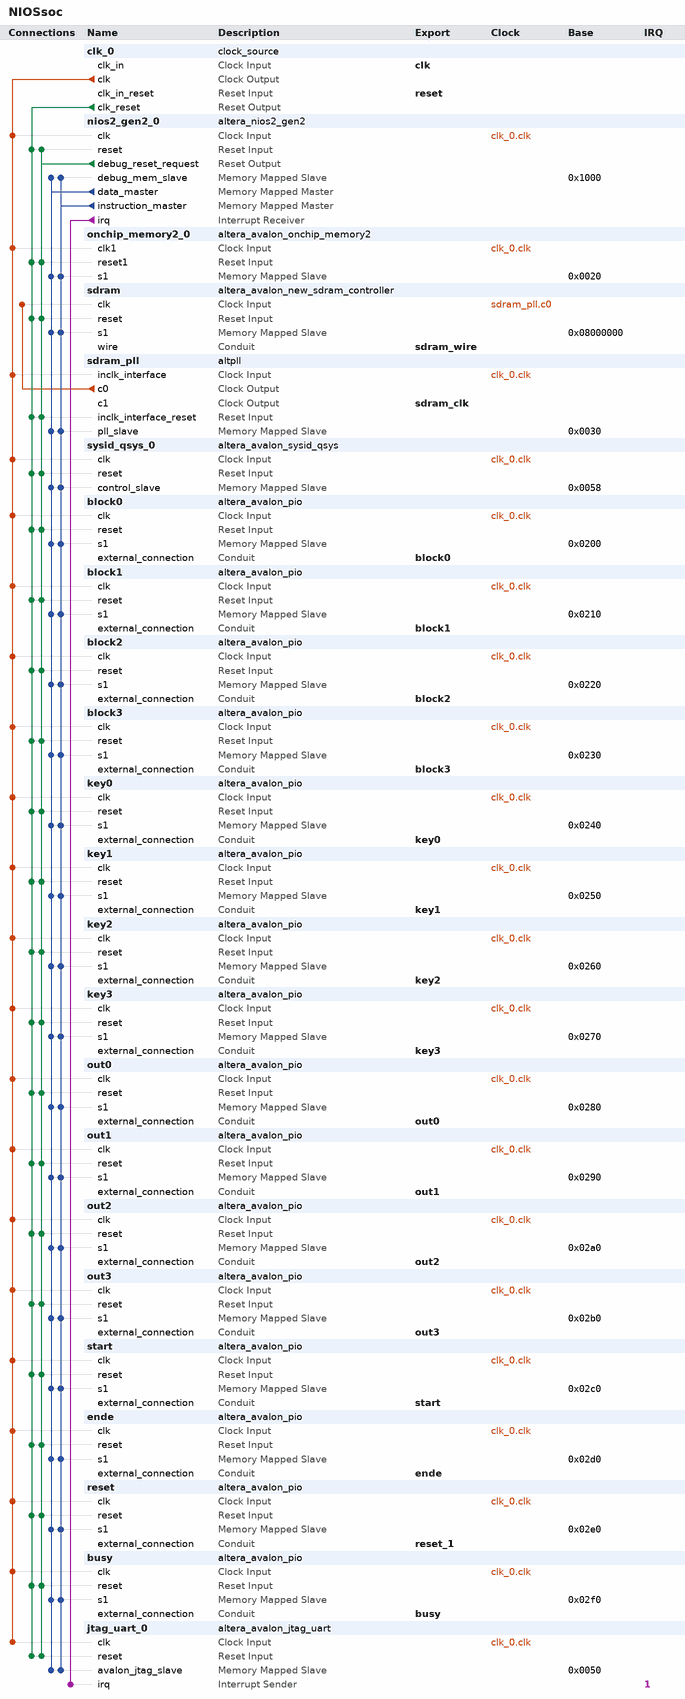
[diagram p0: system contents]
# Platform Designer (Qsys) system NIOSsoc, MAX 10 10M50DAF484C7G
# Parameters at their usual value, and those the tool derives, are not listed.
package require -exact qsys 18.1
create_system NIOSsoc
set_project_property DEVICE_FAMILY {MAX 10}
set_project_property DEVICE 10M50DAF484C7G

add_instance clk_0 clock_source 18.1
set_instance_parameter_value clk_0 clockFrequency 50000000

add_instance nios2_gen2_0 altera_nios2_gen2 18.1
set_instance_parameter_value nios2_gen2_0 dcache_size 2048
set_instance_parameter_value nios2_gen2_0 exceptionSlave sdram.s1
set_instance_parameter_value nios2_gen2_0 icache_size 4096
set_instance_parameter_value nios2_gen2_0 impl Tiny
set_instance_parameter_value nios2_gen2_0 resetSlave sdram.s1

add_instance onchip_memory2_0 altera_avalon_onchip_memory2 18.1
set_instance_parameter_value onchip_memory2_0 dataWidth 32
set_instance_parameter_value onchip_memory2_0 dualPort false
set_instance_parameter_value onchip_memory2_0 initMemContent true
set_instance_parameter_value onchip_memory2_0 initializationFileName onchip_mem.hex
set_instance_parameter_value onchip_memory2_0 memorySize 16

add_instance sdram altera_avalon_new_sdram_controller 18.1
set_instance_parameter_value sdram TAC 5.4
set_instance_parameter_value sdram TRCD 20.0
set_instance_parameter_value sdram TRP 20.0
set_instance_parameter_value sdram casLatency 3
set_instance_parameter_value sdram columnWidth 10
set_instance_parameter_value sdram dataWidth 16
set_instance_parameter_value sdram generateSimulationModel false
set_instance_parameter_value sdram model single_Micron_MT48LC4M32B2_7_chip
set_instance_parameter_value sdram numberOfBanks 4
set_instance_parameter_value sdram numberOfChipSelects 1
set_instance_parameter_value sdram powerUpDelay 200.0
set_instance_parameter_value sdram refreshPeriod 15.625
set_instance_parameter_value sdram rowWidth 13

add_instance sdram_pll altpll 18.1
set_instance_parameter_value sdram_pll CLK0_DIVIDE_BY 1
set_instance_parameter_value sdram_pll CLK0_MULTIPLY_BY 1
set_instance_parameter_value sdram_pll CLK1_DIVIDE_BY 1
set_instance_parameter_value sdram_pll CLK1_DUTY_CYCLE 50
set_instance_parameter_value sdram_pll CLK1_MULTIPLY_BY 1
set_instance_parameter_value sdram_pll CLK1_PHASE_SHIFT -1000
set_instance_parameter_value sdram_pll INCLK0_INPUT_FREQUENCY 20000
set_instance_parameter_value sdram_pll PORT_ARESET PORT_UNUSED
set_instance_parameter_value sdram_pll PORT_LOCKED PORT_UNUSED
set_instance_parameter_value sdram_pll PORT_clk1 PORT_USED
set_instance_parameter_value sdram_pll PORT_clk2 PORT_UNUSED
set_instance_parameter_value sdram_pll PORT_clk3 PORT_UNUSED

add_instance sysid_qsys_0 altera_avalon_sysid_qsys 18.1
set_instance_parameter_value sysid_qsys_0 id 0

add_instance block0 altera_avalon_pio 18.1
set_instance_parameter_value block0 direction Output
set_instance_parameter_value block0 width 32

add_instance block1 altera_avalon_pio 18.1
set_instance_parameter_value block1 direction Output
set_instance_parameter_value block1 width 32

add_instance block2 altera_avalon_pio 18.1
set_instance_parameter_value block2 direction Output
set_instance_parameter_value block2 width 32

add_instance block3 altera_avalon_pio 18.1
set_instance_parameter_value block3 direction Output
set_instance_parameter_value block3 width 32

add_instance key0 altera_avalon_pio 18.1
set_instance_parameter_value key0 direction Output
set_instance_parameter_value key0 width 32

add_instance key1 altera_avalon_pio 18.1
set_instance_parameter_value key1 direction Output
set_instance_parameter_value key1 width 32

add_instance key2 altera_avalon_pio 18.1
set_instance_parameter_value key2 direction Output
set_instance_parameter_value key2 width 32

add_instance key3 altera_avalon_pio 18.1
set_instance_parameter_value key3 direction Output
set_instance_parameter_value key3 width 32

add_instance out0 altera_avalon_pio 18.1
set_instance_parameter_value out0 direction Input
set_instance_parameter_value out0 width 32

add_instance out1 altera_avalon_pio 18.1
set_instance_parameter_value out1 direction Input
set_instance_parameter_value out1 width 32

add_instance out2 altera_avalon_pio 18.1
set_instance_parameter_value out2 direction Input
set_instance_parameter_value out2 width 32

add_instance out3 altera_avalon_pio 18.1
set_instance_parameter_value out3 direction Input
set_instance_parameter_value out3 width 32

add_instance start altera_avalon_pio 18.1
set_instance_parameter_value start direction Output
set_instance_parameter_value start width 1

add_instance ende altera_avalon_pio 18.1
set_instance_parameter_value ende direction Output
set_instance_parameter_value ende width 1

add_instance reset altera_avalon_pio 18.1
set_instance_parameter_value reset direction Output
set_instance_parameter_value reset width 1

add_instance busy altera_avalon_pio 18.1
set_instance_parameter_value busy direction Input
set_instance_parameter_value busy width 1

add_instance jtag_uart_0 altera_avalon_jtag_uart 18.1
set_instance_parameter_value jtag_uart_0 simInteractiveOptions NO_INTERACTIVE_WINDOWS

# connections
add_connection clk_0.clk block0.clk clock
add_connection clk_0.clk block1.clk clock
add_connection clk_0.clk block2.clk clock
add_connection clk_0.clk block3.clk clock
add_connection clk_0.clk busy.clk clock
add_connection clk_0.clk ende.clk clock
add_connection clk_0.clk jtag_uart_0.clk clock
add_connection clk_0.clk key0.clk clock
add_connection clk_0.clk key1.clk clock
add_connection clk_0.clk key2.clk clock
add_connection clk_0.clk key3.clk clock
add_connection clk_0.clk nios2_gen2_0.clk clock
add_connection clk_0.clk onchip_memory2_0.clk1 clock
add_connection clk_0.clk out0.clk clock
add_connection clk_0.clk out1.clk clock
add_connection clk_0.clk out2.clk clock
add_connection clk_0.clk out3.clk clock
add_connection clk_0.clk reset.clk clock
add_connection clk_0.clk sdram_pll.inclk_interface clock
add_connection clk_0.clk start.clk clock
add_connection clk_0.clk sysid_qsys_0.clk clock
add_connection sdram_pll.c0 sdram.clk clock
add_connection clk_0.clk_reset block0.reset reset
add_connection clk_0.clk_reset block1.reset reset
add_connection clk_0.clk_reset block2.reset reset
add_connection clk_0.clk_reset block3.reset reset
add_connection clk_0.clk_reset busy.reset reset
add_connection clk_0.clk_reset ende.reset reset
add_connection clk_0.clk_reset jtag_uart_0.reset reset
add_connection clk_0.clk_reset key0.reset reset
add_connection clk_0.clk_reset key1.reset reset
add_connection clk_0.clk_reset key2.reset reset
add_connection clk_0.clk_reset key3.reset reset
add_connection clk_0.clk_reset nios2_gen2_0.reset reset
add_connection clk_0.clk_reset onchip_memory2_0.reset1 reset
add_connection clk_0.clk_reset out0.reset reset
add_connection clk_0.clk_reset out1.reset reset
add_connection clk_0.clk_reset out2.reset reset
add_connection clk_0.clk_reset out3.reset reset
add_connection clk_0.clk_reset reset.reset reset
add_connection clk_0.clk_reset sdram.reset reset
add_connection clk_0.clk_reset sdram_pll.inclk_interface_reset reset
add_connection clk_0.clk_reset start.reset reset
add_connection clk_0.clk_reset sysid_qsys_0.reset reset
add_connection nios2_gen2_0.debug_reset_request block0.reset reset
add_connection nios2_gen2_0.debug_reset_request block1.reset reset
add_connection nios2_gen2_0.debug_reset_request block2.reset reset
add_connection nios2_gen2_0.debug_reset_request block3.reset reset
add_connection nios2_gen2_0.debug_reset_request busy.reset reset
add_connection nios2_gen2_0.debug_reset_request ende.reset reset
add_connection nios2_gen2_0.debug_reset_request jtag_uart_0.reset reset
add_connection nios2_gen2_0.debug_reset_request key0.reset reset
add_connection nios2_gen2_0.debug_reset_request key1.reset reset
add_connection nios2_gen2_0.debug_reset_request key2.reset reset
add_connection nios2_gen2_0.debug_reset_request key3.reset reset
add_connection nios2_gen2_0.debug_reset_request nios2_gen2_0.reset reset
add_connection nios2_gen2_0.debug_reset_request onchip_memory2_0.reset1 reset
add_connection nios2_gen2_0.debug_reset_request out0.reset reset
add_connection nios2_gen2_0.debug_reset_request out1.reset reset
add_connection nios2_gen2_0.debug_reset_request out2.reset reset
add_connection nios2_gen2_0.debug_reset_request out3.reset reset
add_connection nios2_gen2_0.debug_reset_request reset.reset reset
add_connection nios2_gen2_0.debug_reset_request sdram.reset reset
add_connection nios2_gen2_0.debug_reset_request sdram_pll.inclk_interface_reset reset
add_connection nios2_gen2_0.debug_reset_request start.reset reset
add_connection nios2_gen2_0.debug_reset_request sysid_qsys_0.reset reset
add_connection nios2_gen2_0.data_master block0.s1 avalon
set_connection_parameter_value nios2_gen2_0.data_master/block0.s1 baseAddress 0x0200
add_connection nios2_gen2_0.data_master block1.s1 avalon
set_connection_parameter_value nios2_gen2_0.data_master/block1.s1 baseAddress 0x0210
add_connection nios2_gen2_0.data_master block2.s1 avalon
set_connection_parameter_value nios2_gen2_0.data_master/block2.s1 baseAddress 0x0220
add_connection nios2_gen2_0.data_master block3.s1 avalon
set_connection_parameter_value nios2_gen2_0.data_master/block3.s1 baseAddress 0x0230
add_connection nios2_gen2_0.data_master busy.s1 avalon
set_connection_parameter_value nios2_gen2_0.data_master/busy.s1 baseAddress 0x02f0
add_connection nios2_gen2_0.data_master ende.s1 avalon
set_connection_parameter_value nios2_gen2_0.data_master/ende.s1 baseAddress 0x02d0
add_connection nios2_gen2_0.data_master jtag_uart_0.avalon_jtag_slave avalon
set_connection_parameter_value nios2_gen2_0.data_master/jtag_uart_0.avalon_jtag_slave baseAddress 0x0050
add_connection nios2_gen2_0.data_master key0.s1 avalon
set_connection_parameter_value nios2_gen2_0.data_master/key0.s1 baseAddress 0x0240
add_connection nios2_gen2_0.data_master key1.s1 avalon
set_connection_parameter_value nios2_gen2_0.data_master/key1.s1 baseAddress 0x0250
add_connection nios2_gen2_0.data_master key2.s1 avalon
set_connection_parameter_value nios2_gen2_0.data_master/key2.s1 baseAddress 0x0260
add_connection nios2_gen2_0.data_master key3.s1 avalon
set_connection_parameter_value nios2_gen2_0.data_master/key3.s1 baseAddress 0x0270
add_connection nios2_gen2_0.data_master nios2_gen2_0.debug_mem_slave avalon
set_connection_parameter_value nios2_gen2_0.data_master/nios2_gen2_0.debug_mem_slave baseAddress 0x1000
add_connection nios2_gen2_0.data_master onchip_memory2_0.s1 avalon
set_connection_parameter_value nios2_gen2_0.data_master/onchip_memory2_0.s1 baseAddress 0x0020
add_connection nios2_gen2_0.data_master out0.s1 avalon
set_connection_parameter_value nios2_gen2_0.data_master/out0.s1 baseAddress 0x0280
add_connection nios2_gen2_0.data_master out1.s1 avalon
set_connection_parameter_value nios2_gen2_0.data_master/out1.s1 baseAddress 0x0290
add_connection nios2_gen2_0.data_master out2.s1 avalon
set_connection_parameter_value nios2_gen2_0.data_master/out2.s1 baseAddress 0x02a0
add_connection nios2_gen2_0.data_master out3.s1 avalon
set_connection_parameter_value nios2_gen2_0.data_master/out3.s1 baseAddress 0x02b0
add_connection nios2_gen2_0.data_master reset.s1 avalon
set_connection_parameter_value nios2_gen2_0.data_master/reset.s1 baseAddress 0x02e0
add_connection nios2_gen2_0.data_master sdram.s1 avalon
set_connection_parameter_value nios2_gen2_0.data_master/sdram.s1 baseAddress 0x08000000
add_connection nios2_gen2_0.data_master sdram_pll.pll_slave avalon
set_connection_parameter_value nios2_gen2_0.data_master/sdram_pll.pll_slave baseAddress 0x0030
add_connection nios2_gen2_0.data_master start.s1 avalon
set_connection_parameter_value nios2_gen2_0.data_master/start.s1 baseAddress 0x02c0
add_connection nios2_gen2_0.data_master sysid_qsys_0.control_slave avalon
set_connection_parameter_value nios2_gen2_0.data_master/sysid_qsys_0.control_slave baseAddress 0x0058
add_connection nios2_gen2_0.instruction_master block0.s1 avalon
set_connection_parameter_value nios2_gen2_0.instruction_master/block0.s1 baseAddress 0x0200
add_connection nios2_gen2_0.instruction_master block1.s1 avalon
set_connection_parameter_value nios2_gen2_0.instruction_master/block1.s1 baseAddress 0x0210
add_connection nios2_gen2_0.instruction_master block2.s1 avalon
set_connection_parameter_value nios2_gen2_0.instruction_master/block2.s1 baseAddress 0x0220
add_connection nios2_gen2_0.instruction_master block3.s1 avalon
set_connection_parameter_value nios2_gen2_0.instruction_master/block3.s1 baseAddress 0x0230
add_connection nios2_gen2_0.instruction_master busy.s1 avalon
set_connection_parameter_value nios2_gen2_0.instruction_master/busy.s1 baseAddress 0x02f0
add_connection nios2_gen2_0.instruction_master ende.s1 avalon
set_connection_parameter_value nios2_gen2_0.instruction_master/ende.s1 baseAddress 0x02d0
add_connection nios2_gen2_0.instruction_master jtag_uart_0.avalon_jtag_slave avalon
set_connection_parameter_value nios2_gen2_0.instruction_master/jtag_uart_0.avalon_jtag_slave baseAddress 0x0050
add_connection nios2_gen2_0.instruction_master key0.s1 avalon
set_connection_parameter_value nios2_gen2_0.instruction_master/key0.s1 baseAddress 0x0240
add_connection nios2_gen2_0.instruction_master key1.s1 avalon
set_connection_parameter_value nios2_gen2_0.instruction_master/key1.s1 baseAddress 0x0250
add_connection nios2_gen2_0.instruction_master key2.s1 avalon
set_connection_parameter_value nios2_gen2_0.instruction_master/key2.s1 baseAddress 0x0260
add_connection nios2_gen2_0.instruction_master key3.s1 avalon
set_connection_parameter_value nios2_gen2_0.instruction_master/key3.s1 baseAddress 0x0270
add_connection nios2_gen2_0.instruction_master nios2_gen2_0.debug_mem_slave avalon
set_connection_parameter_value nios2_gen2_0.instruction_master/nios2_gen2_0.debug_mem_slave baseAddress 0x1000
add_connection nios2_gen2_0.instruction_master onchip_memory2_0.s1 avalon
set_connection_parameter_value nios2_gen2_0.instruction_master/onchip_memory2_0.s1 baseAddress 0x0020
add_connection nios2_gen2_0.instruction_master out0.s1 avalon
set_connection_parameter_value nios2_gen2_0.instruction_master/out0.s1 baseAddress 0x0280
add_connection nios2_gen2_0.instruction_master out1.s1 avalon
set_connection_parameter_value nios2_gen2_0.instruction_master/out1.s1 baseAddress 0x0290
add_connection nios2_gen2_0.instruction_master out2.s1 avalon
set_connection_parameter_value nios2_gen2_0.instruction_master/out2.s1 baseAddress 0x02a0
add_connection nios2_gen2_0.instruction_master out3.s1 avalon
set_connection_parameter_value nios2_gen2_0.instruction_master/out3.s1 baseAddress 0x02b0
add_connection nios2_gen2_0.instruction_master reset.s1 avalon
set_connection_parameter_value nios2_gen2_0.instruction_master/reset.s1 baseAddress 0x02e0
add_connection nios2_gen2_0.instruction_master sdram.s1 avalon
set_connection_parameter_value nios2_gen2_0.instruction_master/sdram.s1 baseAddress 0x08000000
add_connection nios2_gen2_0.instruction_master sdram_pll.pll_slave avalon
set_connection_parameter_value nios2_gen2_0.instruction_master/sdram_pll.pll_slave baseAddress 0x0030
add_connection nios2_gen2_0.instruction_master start.s1 avalon
set_connection_parameter_value nios2_gen2_0.instruction_master/start.s1 baseAddress 0x02c0
add_connection nios2_gen2_0.instruction_master sysid_qsys_0.control_slave avalon
set_connection_parameter_value nios2_gen2_0.instruction_master/sysid_qsys_0.control_slave baseAddress 0x0058
add_connection nios2_gen2_0.irq jtag_uart_0.irq interrupt
set_connection_parameter_value nios2_gen2_0.irq/jtag_uart_0.irq irqNumber 1

# exported interfaces
add_interface block0 conduit end
set_interface_property block0 EXPORT_OF block0.external_connection
add_interface block1 conduit end
set_interface_property block1 EXPORT_OF block1.external_connection
add_interface block2 conduit end
set_interface_property block2 EXPORT_OF block2.external_connection
add_interface block3 conduit end
set_interface_property block3 EXPORT_OF block3.external_connection
add_interface busy conduit end
set_interface_property busy EXPORT_OF busy.external_connection
add_interface clk clock sink
set_interface_property clk EXPORT_OF clk_0.clk_in
add_interface ende conduit end
set_interface_property ende EXPORT_OF ende.external_connection
add_interface key0 conduit end
set_interface_property key0 EXPORT_OF key0.external_connection
add_interface key1 conduit end
set_interface_property key1 EXPORT_OF key1.external_connection
add_interface key2 conduit end
set_interface_property key2 EXPORT_OF key2.external_connection
add_interface key3 conduit end
set_interface_property key3 EXPORT_OF key3.external_connection
add_interface out0 conduit end
set_interface_property out0 EXPORT_OF out0.external_connection
add_interface out1 conduit end
set_interface_property out1 EXPORT_OF out1.external_connection
add_interface out2 conduit end
set_interface_property out2 EXPORT_OF out2.external_connection
add_interface out3 conduit end
set_interface_property out3 EXPORT_OF out3.external_connection
add_interface reset reset sink
set_interface_property reset EXPORT_OF clk_0.clk_in_reset
add_interface reset_1 conduit end
set_interface_property reset_1 EXPORT_OF reset.external_connection
add_interface sdram_clk clock source
set_interface_property sdram_clk EXPORT_OF sdram_pll.c1
add_interface sdram_wire conduit end
set_interface_property sdram_wire EXPORT_OF sdram.wire
add_interface start conduit end
set_interface_property start EXPORT_OF start.external_connection

set_interconnect_requirement {$system} qsys_mm.clockCrossingAdapter HANDSHAKE
set_interconnect_requirement {$system} qsys_mm.enableEccProtection FALSE
set_interconnect_requirement {$system} qsys_mm.insertDefaultSlave FALSE
set_interconnect_requirement {$system} qsys_mm.maxAdditionalLatency 1

save_system NIOSsoc.qsys
